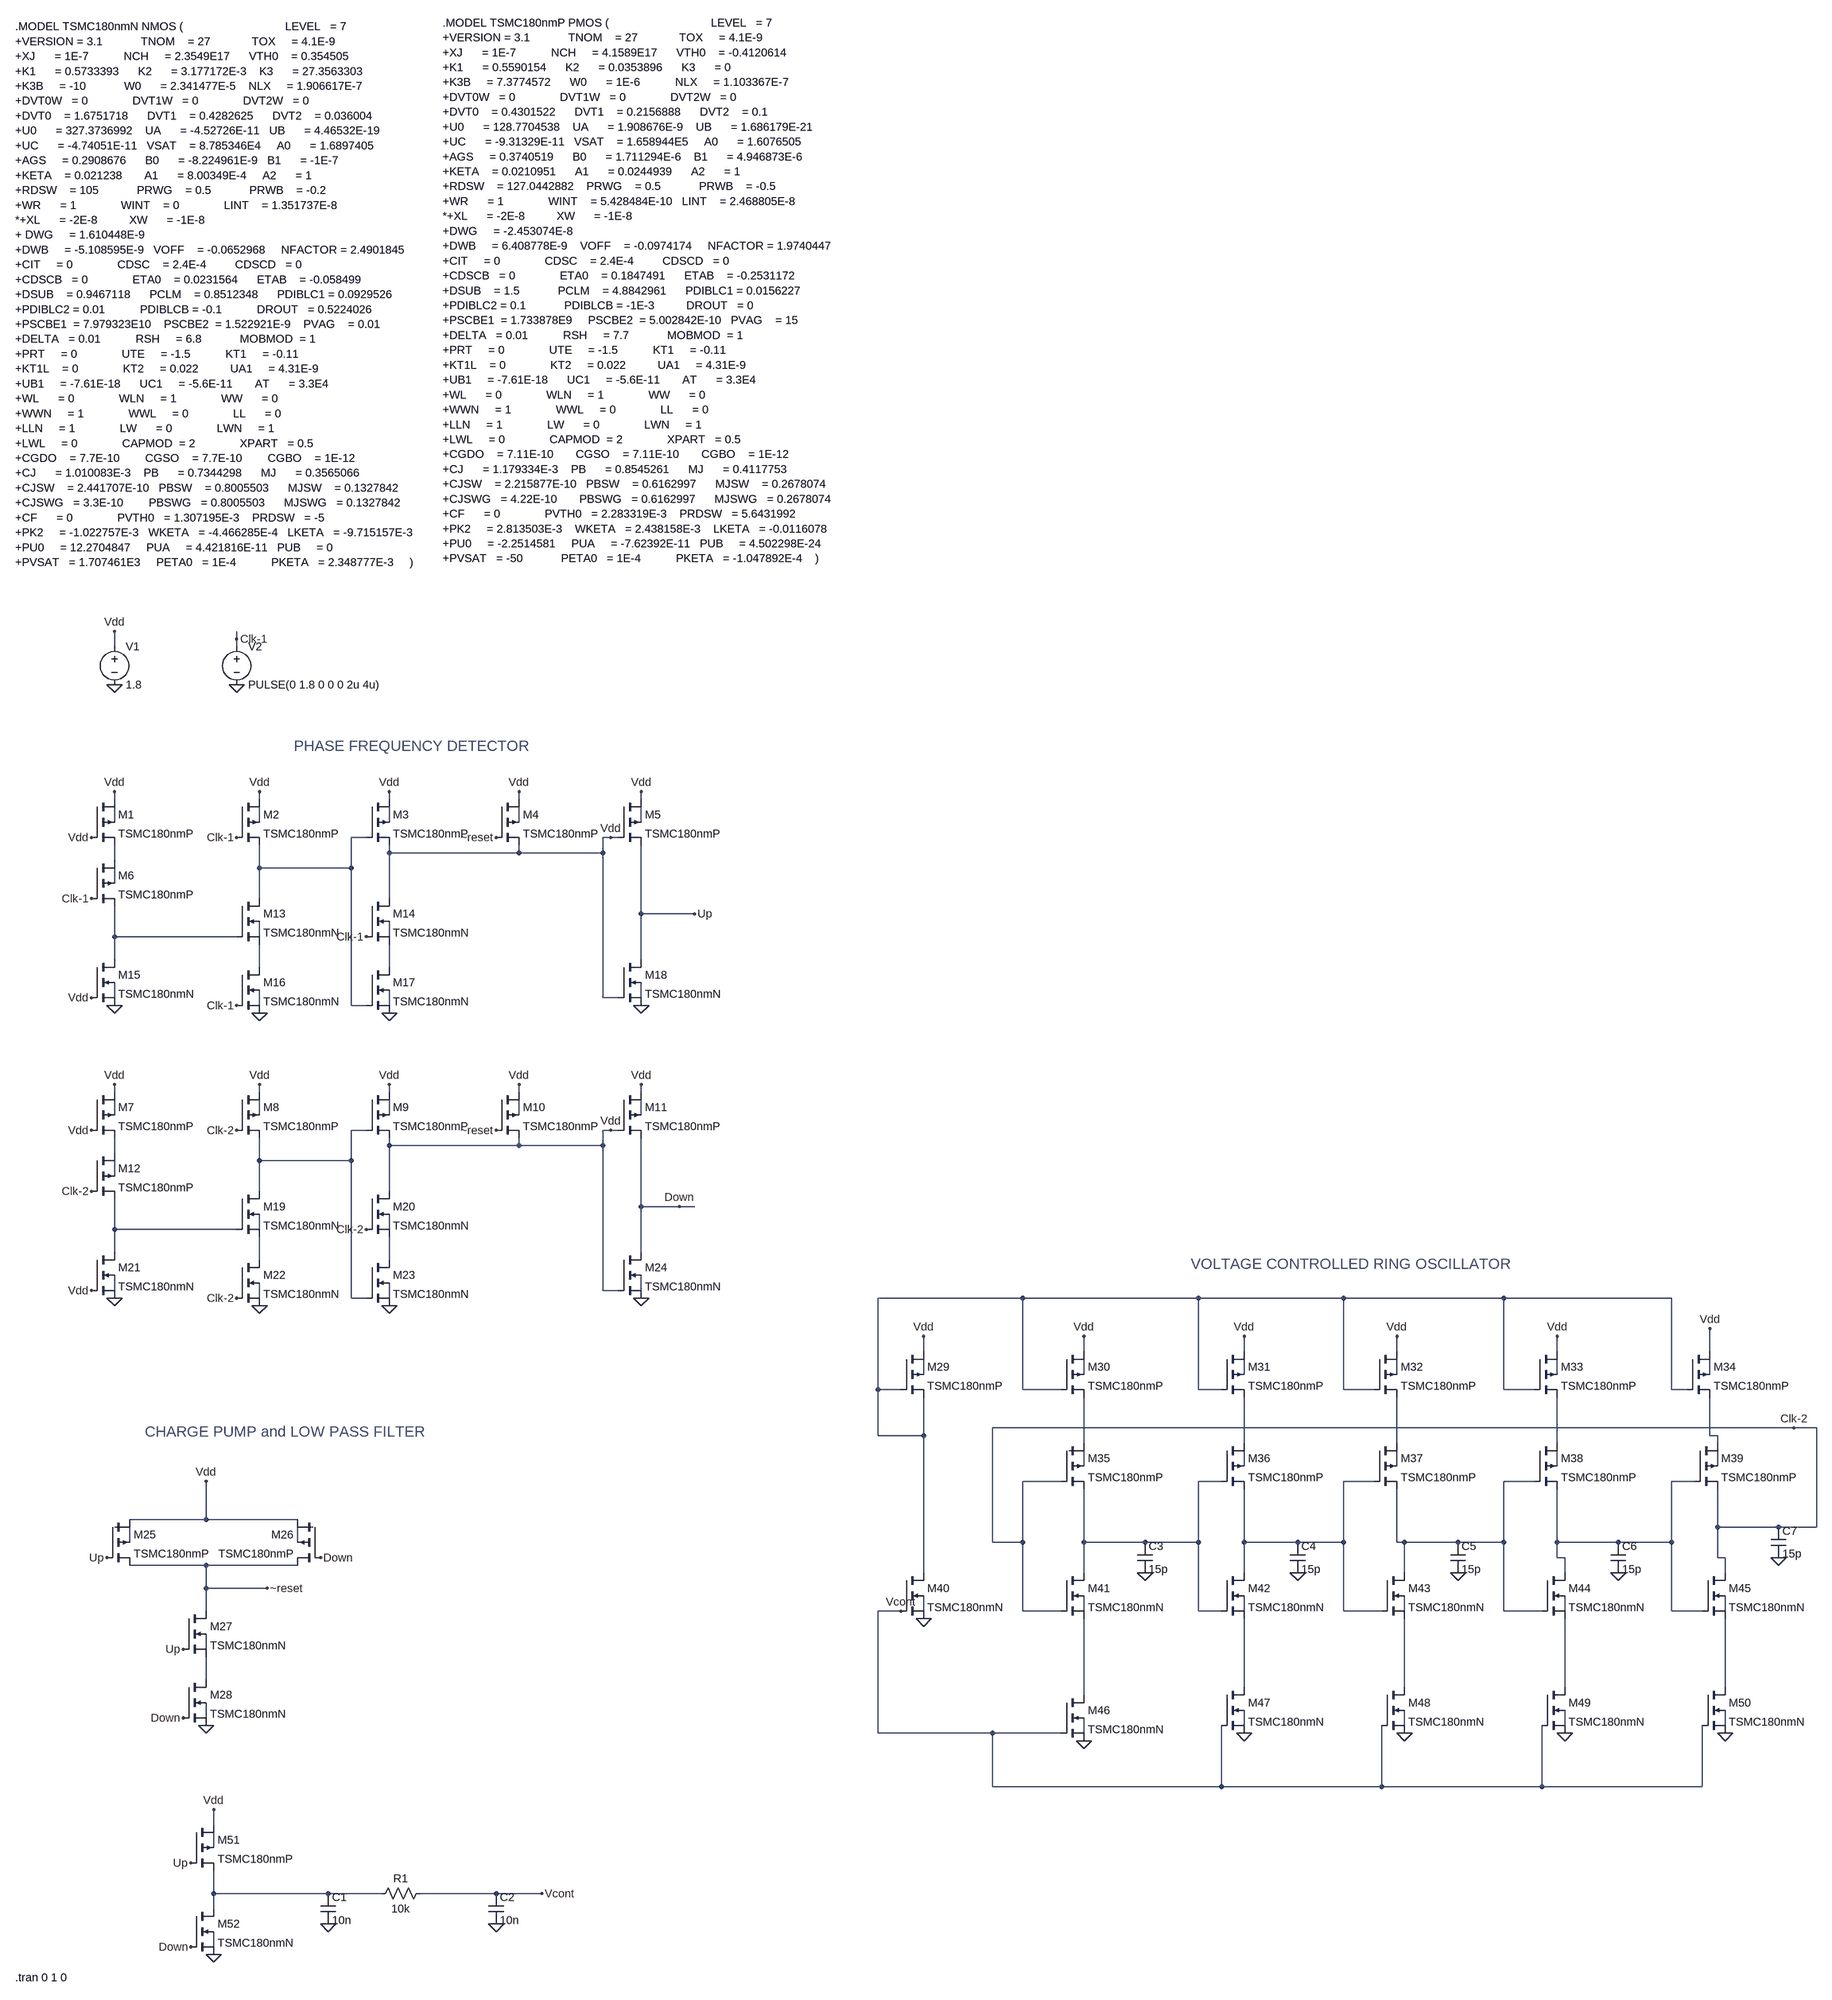
[diagram p0: schematic On-chip_PLL.asc]
On-chip_PLL.asc, the LTspice schematic file:
Version 4
SHEET 1 3548 2176
WIRE 80 -704 80 -720
WIRE -176 -688 -176 -720
WIRE 80 -688 80 -704
WIRE -176 -368 -176 -384
WIRE 128 -368 128 -384
WIRE 400 -368 400 -384
WIRE 672 -368 672 -384
WIRE 928 -368 928 -384
WIRE -176 -352 -192 -352
WIRE 128 -352 112 -352
WIRE 400 -352 384 -352
WIRE 672 -352 656 -352
WIRE 928 -352 912 -352
WIRE -176 -320 -176 -352
WIRE 128 -320 128 -352
WIRE 400 -320 400 -352
WIRE 672 -320 672 -352
WIRE 928 -320 928 -352
WIRE 352 -288 320 -288
WIRE 864 -288 848 -288
WIRE 880 -288 864 -288
WIRE 400 -256 400 -272
WIRE 672 -256 672 -272
WIRE 672 -256 400 -256
WIRE 848 -256 848 -288
WIRE 848 -256 672 -256
WIRE -176 -240 -176 -272
WIRE -176 -224 -192 -224
WIRE 128 -224 128 -272
WIRE 320 -224 320 -288
WIRE 320 -224 128 -224
WIRE -176 -192 -176 -224
WIRE 128 -160 128 -224
WIRE 400 -160 400 -256
WIRE 928 -128 928 -272
WIRE 1040 -128 928 -128
WIRE -176 -80 -176 -144
WIRE 80 -80 -176 -80
WIRE 128 -80 128 -112
WIRE 128 -80 112 -80
WIRE 400 -80 400 -112
WIRE 400 -80 384 -80
WIRE -176 -32 -176 -80
WIRE 928 -32 928 -128
WIRE 128 -16 128 -64
WIRE 400 -16 400 -64
WIRE -176 48 -176 16
WIRE -176 48 -192 48
WIRE 848 48 848 -256
WIRE 880 48 848 48
WIRE 928 48 928 16
WIRE 928 48 912 48
WIRE 128 64 128 32
WIRE 128 64 112 64
WIRE 320 64 320 -224
WIRE 352 64 320 64
WIRE 400 64 400 32
WIRE 400 64 384 64
WIRE -176 304 -176 288
WIRE 128 304 128 288
WIRE 400 304 400 288
WIRE 672 304 672 288
WIRE 928 304 928 288
WIRE -176 320 -192 320
WIRE 128 320 112 320
WIRE 400 320 384 320
WIRE 672 320 656 320
WIRE 928 320 912 320
WIRE -176 352 -176 320
WIRE 128 352 128 320
WIRE 400 352 400 320
WIRE 672 352 672 320
WIRE 928 352 928 320
WIRE 352 384 320 384
WIRE 864 384 848 384
WIRE 880 384 864 384
WIRE 400 416 400 400
WIRE 672 416 672 400
WIRE 672 416 400 416
WIRE 848 416 848 384
WIRE 848 416 672 416
WIRE -176 432 -176 400
WIRE -176 448 -192 448
WIRE 128 448 128 400
WIRE 320 448 320 384
WIRE 320 448 128 448
WIRE -176 480 -176 448
WIRE 128 512 128 448
WIRE 400 512 400 416
WIRE 928 544 928 400
WIRE 1008 544 928 544
WIRE 1040 544 1008 544
WIRE -176 592 -176 528
WIRE 80 592 -176 592
WIRE 128 592 128 560
WIRE 128 592 112 592
WIRE 400 592 400 560
WIRE 400 592 384 592
WIRE -176 640 -176 592
WIRE 928 640 928 544
WIRE 128 656 128 608
WIRE 400 656 400 608
WIRE -176 720 -176 688
WIRE -176 720 -192 720
WIRE 848 720 848 416
WIRE 880 720 848 720
WIRE 928 720 928 688
WIRE 928 720 912 720
WIRE 128 736 128 704
WIRE 128 736 112 736
WIRE 320 736 320 448
WIRE 352 736 320 736
WIRE 400 736 400 704
WIRE 400 736 384 736
WIRE 1728 736 1424 736
WIRE 2096 736 1728 736
WIRE 2400 736 2096 736
WIRE 2736 736 2400 736
WIRE 3088 736 2736 736
WIRE 1520 848 1520 816
WIRE 1856 848 1856 816
WIRE 2192 848 2192 816
WIRE 2512 848 2512 816
WIRE 2848 848 2848 816
WIRE 3168 848 3168 800
WIRE 1520 864 1504 864
WIRE 2192 864 2176 864
WIRE 2512 864 2496 864
WIRE 2848 864 2832 864
WIRE 3168 864 3152 864
WIRE 1520 896 1520 864
WIRE 1856 896 1856 864
WIRE 2192 896 2192 864
WIRE 2512 896 2512 864
WIRE 2848 896 2848 864
WIRE 3168 896 3168 864
WIRE 1424 928 1424 736
WIRE 1472 928 1424 928
WIRE 1728 928 1728 736
WIRE 1808 928 1728 928
WIRE 2096 928 2096 736
WIRE 2144 928 2096 928
WIRE 2400 928 2400 736
WIRE 2464 928 2400 928
WIRE 2736 928 2736 736
WIRE 2800 928 2736 928
WIRE 3088 928 3088 736
WIRE 3120 928 3088 928
WIRE 3344 1008 1664 1008
WIRE 3392 1008 3344 1008
WIRE 1424 1024 1424 928
WIRE 1520 1024 1520 944
WIRE 1520 1024 1424 1024
WIRE 3168 1024 3168 944
WIRE 3184 1024 3168 1024
WIRE 1856 1040 1856 944
WIRE 2192 1040 2192 944
WIRE 2512 1040 2512 944
WIRE 2848 1040 2848 944
WIRE 3184 1040 3184 1024
WIRE 1856 1056 1824 1056
WIRE 2512 1056 2496 1056
WIRE 2848 1056 2832 1056
WIRE 3184 1056 3168 1056
WIRE 1856 1088 1856 1056
WIRE 2192 1088 2192 1056
WIRE 2512 1088 2512 1056
WIRE 2848 1088 2848 1056
WIRE 3184 1088 3184 1056
WIRE 1808 1120 1728 1120
WIRE 2144 1120 2096 1120
WIRE 2464 1120 2400 1120
WIRE 2800 1120 2736 1120
WIRE 3136 1120 3088 1120
WIRE 16 1200 16 1120
WIRE 16 1200 -144 1200
WIRE 208 1200 16 1200
WIRE -144 1216 -176 1216
WIRE 240 1216 208 1216
WIRE 3184 1216 3184 1136
WIRE 3312 1216 3184 1216
WIRE 3392 1216 3392 1008
WIRE 3392 1216 3312 1216
WIRE -144 1248 -144 1216
WIRE 208 1248 208 1216
WIRE 1664 1248 1664 1008
WIRE 1728 1248 1728 1120
WIRE 1728 1248 1664 1248
WIRE 1856 1248 1856 1136
WIRE 1984 1248 1856 1248
WIRE 2096 1248 2096 1120
WIRE 2096 1248 1984 1248
WIRE 2192 1248 2192 1136
WIRE 2304 1248 2192 1248
WIRE 2400 1248 2400 1120
WIRE 2400 1248 2304 1248
WIRE 2512 1248 2512 1136
WIRE 2528 1248 2512 1248
WIRE 2640 1248 2528 1248
WIRE 2736 1248 2736 1120
WIRE 2736 1248 2640 1248
WIRE 2848 1248 2848 1136
WIRE 2976 1248 2848 1248
WIRE 3088 1248 3088 1120
WIRE 3088 1248 2976 1248
WIRE 2848 1280 2848 1248
WIRE 2864 1280 2848 1280
WIRE 3184 1280 3184 1216
WIRE 3200 1280 3184 1280
WIRE 16 1296 -144 1296
WIRE 208 1296 16 1296
WIRE 1520 1312 1520 1024
WIRE 1856 1312 1856 1248
WIRE 2192 1312 2192 1248
WIRE 2528 1312 2528 1248
WIRE 2864 1312 2864 1280
WIRE 3200 1312 3200 1280
WIRE 16 1344 16 1296
WIRE 144 1344 16 1344
WIRE 16 1392 16 1344
WIRE 1472 1392 1424 1392
WIRE 1520 1392 1520 1360
WIRE 1520 1392 1504 1392
WIRE 1728 1392 1728 1248
WIRE 1808 1392 1728 1392
WIRE 1856 1392 1856 1360
WIRE 1856 1392 1840 1392
WIRE 2096 1392 2096 1248
WIRE 2144 1392 2096 1392
WIRE 2192 1392 2192 1360
WIRE 2192 1392 2176 1392
WIRE 2400 1392 2400 1248
WIRE 2480 1392 2400 1392
WIRE 2528 1392 2528 1360
WIRE 2528 1392 2512 1392
WIRE 2736 1392 2736 1248
WIRE 2816 1392 2736 1392
WIRE 2864 1392 2864 1360
WIRE 2864 1392 2848 1392
WIRE 3088 1392 3088 1248
WIRE 3152 1392 3088 1392
WIRE 3200 1392 3200 1360
WIRE 3200 1392 3184 1392
WIRE 16 1472 16 1440
WIRE 16 1536 16 1488
WIRE 2192 1552 2192 1408
WIRE 2528 1552 2528 1408
WIRE 2864 1552 2864 1408
WIRE 3200 1552 3200 1408
WIRE 1856 1568 1856 1408
WIRE 16 1616 16 1584
WIRE 2192 1632 2192 1600
WIRE 2192 1632 2176 1632
WIRE 2528 1632 2528 1600
WIRE 2528 1632 2512 1632
WIRE 2864 1632 2864 1600
WIRE 2864 1632 2848 1632
WIRE 3200 1632 3200 1600
WIRE 3200 1632 3184 1632
WIRE 1424 1648 1424 1392
WIRE 1664 1648 1424 1648
WIRE 1808 1648 1664 1648
WIRE 1856 1648 1856 1616
WIRE 1856 1648 1840 1648
WIRE 1664 1760 1664 1648
WIRE 2144 1760 2144 1632
WIRE 2144 1760 1664 1760
WIRE 2480 1760 2480 1632
WIRE 2480 1760 2144 1760
WIRE 2816 1760 2816 1632
WIRE 2816 1760 2480 1760
WIRE 3152 1760 3152 1632
WIRE 3152 1760 2816 1760
WIRE 32 1840 32 1808
WIRE 32 1856 16 1856
WIRE 32 1888 32 1856
WIRE 32 1984 32 1936
WIRE 272 1984 32 1984
WIRE 384 1984 272 1984
WIRE 624 1984 464 1984
WIRE 720 1984 624 1984
WIRE 32 2016 32 1984
WIRE 32 2096 32 2064
FLAG 1008 544 Down
FLAG 80 -704 Clk-1
FLAG -224 -160 Clk-1
FLAG 80 -288 Clk-1
FLAG 80 64 Clk-1
FLAG 352 -80 Clk-1
FLAG -224 512 Clk-2
FLAG 80 736 Clk-2
FLAG 80 384 Clk-2
FLAG 352 592 Clk-2
FLAG -224 720 Vdd
FLAG -224 384 Vdd
FLAG -224 48 Vdd
FLAG -224 -288 Vdd
FLAG -176 288 Vdd
FLAG 128 288 Vdd
FLAG 400 288 Vdd
FLAG -176 -384 Vdd
FLAG 128 -384 Vdd
FLAG 400 -384 Vdd
FLAG 672 -384 Vdd
FLAG 928 -384 Vdd
FLAG 864 -288 Vdd
FLAG 672 288 Vdd
FLAG 928 288 Vdd
FLAG 864 384 Vdd
FLAG 624 -288 ~reset
FLAG 624 384 ~reset
FLAG -176 -720 Vdd
FLAG -192 1280 Up
FLAG -32 1472 Up
FLAG -32 1616 Down
FLAG 144 1344 ~reset
FLAG 16 1120 Vdd
FLAG 1520 816 Vdd
FLAG 1856 816 Vdd
FLAG 2192 816 Vdd
FLAG 2512 816 Vdd
FLAG 2848 816 Vdd
FLAG 3168 800 Vdd
FLAG 3344 1008 Clk-2
FLAG 1472 1392 Vcont
FLAG 16 1632 0
FLAG -16 2096 Down
FLAG 720 1984 Vcont
FLAG 32 2112 0
FLAG 272 2048 0
FLAG 624 2048 0
FLAG -176 64 0
FLAG 128 80 0
FLAG 400 80 0
FLAG 928 64 0
FLAG -176 736 0
FLAG 128 752 0
FLAG 400 752 0
FLAG 928 736 0
FLAG 1520 1408 0
FLAG 1856 1664 0
FLAG 2192 1648 0
FLAG 2528 1648 0
FLAG 2864 1648 0
FLAG 3200 1648 0
FLAG -176 -608 0
FLAG 80 -608 0
FLAG 1040 -128 Up
FLAG 256 1280 Down
FLAG -16 1920 Up
FLAG 32 1808 Vdd
FLAG 1984 1312 0
FLAG 2304 1312 0
FLAG 2640 1312 0
FLAG 2976 1312 0
FLAG 3312 1280 0
SYMBOL pmos4 -224 -368 R0
SYMATTR InstName M1
SYMATTR Value TSMC180nmP
SYMBOL pmos4 80 -368 R0
SYMATTR InstName M2
SYMATTR Value TSMC180nmP
SYMBOL pmos4 352 -368 R0
SYMATTR InstName M3
SYMATTR Value TSMC180nmP
SYMBOL pmos4 624 -368 R0
SYMATTR InstName M4
SYMATTR Value TSMC180nmP
SYMBOL pmos4 880 -368 R0
SYMATTR InstName M5
SYMATTR Value TSMC180nmP
SYMBOL pmos4 -224 -240 R0
SYMATTR InstName M6
SYMATTR Value TSMC180nmP
SYMBOL nmos4 80 -160 R0
SYMATTR InstName M13
SYMATTR Value TSMC180nmN
SYMBOL nmos4 352 -160 R0
SYMATTR InstName M14
SYMATTR Value TSMC180nmN
SYMBOL nmos4 -224 -32 R0
SYMATTR InstName M15
SYMATTR Value TSMC180nmN
SYMBOL nmos4 80 -16 R0
SYMATTR InstName M16
SYMATTR Value TSMC180nmN
SYMBOL nmos4 352 -16 R0
SYMATTR InstName M17
SYMATTR Value TSMC180nmN
SYMBOL nmos4 880 -32 R0
SYMATTR InstName M18
SYMATTR Value TSMC180nmN
SYMBOL pmos4 -224 304 R0
SYMATTR InstName M7
SYMATTR Value TSMC180nmP
SYMBOL pmos4 80 304 R0
SYMATTR InstName M8
SYMATTR Value TSMC180nmP
SYMBOL pmos4 352 304 R0
SYMATTR InstName M9
SYMATTR Value TSMC180nmP
SYMBOL pmos4 624 304 R0
SYMATTR InstName M10
SYMATTR Value TSMC180nmP
SYMBOL pmos4 880 304 R0
SYMATTR InstName M11
SYMATTR Value TSMC180nmP
SYMBOL pmos4 -224 432 R0
SYMATTR InstName M12
SYMATTR Value TSMC180nmP
SYMBOL nmos4 80 512 R0
SYMATTR InstName M19
SYMATTR Value TSMC180nmN
SYMBOL nmos4 352 512 R0
SYMATTR InstName M20
SYMATTR Value TSMC180nmN
SYMBOL nmos4 -224 640 R0
SYMATTR InstName M21
SYMATTR Value TSMC180nmN
SYMBOL nmos4 80 656 R0
SYMATTR InstName M22
SYMATTR Value TSMC180nmN
SYMBOL nmos4 352 656 R0
SYMATTR InstName M23
SYMATTR Value TSMC180nmN
SYMBOL nmos4 880 640 R0
SYMATTR InstName M24
SYMATTR Value TSMC180nmN
SYMBOL voltage -176 -704 R0
WINDOW 123 0 0 Left 0
WINDOW 39 0 0 Left 0
SYMATTR InstName V1
SYMATTR Value 1.8
SYMBOL voltage 80 -704 R0
WINDOW 123 0 0 Left 0
WINDOW 39 0 0 Left 0
SYMATTR InstName V2
SYMATTR Value PULSE(0 1.8 0 0 0 2u 4u)
SYMBOL pmos4 -192 1200 R0
SYMATTR InstName M25
SYMATTR Value TSMC180nmP
SYMBOL nmos4 -32 1392 R0
SYMATTR InstName M27
SYMATTR Value TSMC180nmN
SYMBOL nmos4 -32 1536 R0
SYMATTR InstName M28
SYMATTR Value TSMC180nmN
SYMBOL pmos4 1472 848 R0
SYMATTR InstName M29
SYMATTR Value TSMC180nmP
SYMBOL pmos4 1808 848 R0
SYMATTR InstName M30
SYMATTR Value TSMC180nmP
SYMBOL pmos4 2144 848 R0
SYMATTR InstName M31
SYMATTR Value TSMC180nmP
SYMBOL pmos4 2464 848 R0
SYMATTR InstName M32
SYMATTR Value TSMC180nmP
SYMBOL pmos4 2800 848 R0
SYMATTR InstName M33
SYMATTR Value TSMC180nmP
SYMBOL pmos4 3120 848 R0
SYMATTR InstName M34
SYMATTR Value TSMC180nmP
SYMBOL pmos4 1808 1040 R0
SYMATTR InstName M35
SYMATTR Value TSMC180nmP
SYMBOL pmos4 2144 1040 R0
SYMATTR InstName M36
SYMATTR Value TSMC180nmP
SYMBOL pmos4 2464 1040 R0
SYMATTR InstName M37
SYMATTR Value TSMC180nmP
SYMBOL pmos4 2800 1040 R0
SYMATTR InstName M38
SYMATTR Value TSMC180nmP
SYMBOL pmos4 3136 1040 R0
SYMATTR InstName M39
SYMATTR Value TSMC180nmP
SYMBOL nmos4 1472 1312 R0
SYMATTR InstName M40
SYMATTR Value TSMC180nmN
SYMBOL nmos4 1808 1312 R0
SYMATTR InstName M41
SYMATTR Value TSMC180nmN
SYMBOL nmos4 2144 1312 R0
SYMATTR InstName M42
SYMATTR Value TSMC180nmN
SYMBOL nmos4 2480 1312 R0
SYMATTR InstName M43
SYMATTR Value TSMC180nmN
SYMBOL nmos4 2816 1312 R0
SYMATTR InstName M44
SYMATTR Value TSMC180nmN
SYMBOL nmos4 3152 1312 R0
SYMATTR InstName M45
SYMATTR Value TSMC180nmN
SYMBOL nmos4 1808 1568 R0
SYMATTR InstName M46
SYMATTR Value TSMC180nmN
SYMBOL nmos4 2144 1552 R0
SYMATTR InstName M47
SYMATTR Value TSMC180nmN
SYMBOL nmos4 2480 1552 R0
SYMATTR InstName M48
SYMATTR Value TSMC180nmN
SYMBOL nmos4 2816 1552 R0
SYMATTR InstName M49
SYMATTR Value TSMC180nmN
SYMBOL nmos4 3152 1552 R0
SYMATTR InstName M50
SYMATTR Value TSMC180nmN
SYMBOL nmos4 -16 2016 R0
SYMATTR InstName M52
SYMATTR Value TSMC180nmN
SYMBOL cap 256 1984 R0
SYMATTR InstName C1
SYMATTR Value 10n
SYMBOL cap 608 1984 R0
SYMATTR InstName C2
SYMATTR Value 10n
SYMBOL res 480 1968 R90
WINDOW 0 0 56 VBottom 2
WINDOW 3 32 56 VTop 2
SYMATTR InstName R1
SYMATTR Value 10k
SYMBOL pmos4 256 1200 M0
SYMATTR InstName M26
SYMATTR Value TSMC180nmP
SYMBOL pmos4 -16 1840 R0
SYMATTR InstName M51
SYMATTR Value TSMC180nmP
SYMBOL cap 1968 1248 R0
SYMATTR InstName C3
SYMATTR Value 15p
SYMBOL cap 2288 1248 R0
SYMATTR InstName C4
SYMATTR Value 15p
SYMBOL cap 2624 1248 R0
SYMATTR InstName C5
SYMATTR Value 15p
SYMBOL cap 2960 1248 R0
SYMATTR InstName C6
SYMATTR Value 15p
SYMBOL cap 3296 1216 R0
SYMATTR InstName C7
SYMATTR Value 15p
TEXT -384 -2008 Left 2 !.MODEL TSMC180nmN NMOS (                                LEVEL   = 7\n+VERSION = 3.1            TNOM    = 27             TOX     = 4.1E-9\n+XJ      = 1E-7           NCH     = 2.3549E17      VTH0    = 0.354505\n+K1      = 0.5733393      K2      = 3.177172E-3    K3      = 27.3563303\n+K3B     = -10            W0      = 2.341477E-5    NLX     = 1.906617E-7\n+DVT0W   = 0              DVT1W   = 0              DVT2W   = 0\n+DVT0    = 1.6751718      DVT1    = 0.4282625      DVT2    = 0.036004\n+U0      = 327.3736992    UA      = -4.52726E-11   UB      = 4.46532E-19\n+UC      = -4.74051E-11   VSAT    = 8.785346E4     A0      = 1.6897405\n+AGS     = 0.2908676      B0      = -8.224961E-9   B1      = -1E-7\n+KETA    = 0.021238       A1      = 8.00349E-4     A2      = 1\n+RDSW    = 105            PRWG    = 0.5            PRWB    = -0.2\n+WR      = 1              WINT    = 0              LINT    = 1.351737E-8\n*+XL      = -2E-8          XW      = -1E-8         \n+ DWG     = 1.610448E-9\n+DWB     = -5.108595E-9   VOFF    = -0.0652968     NFACTOR = 2.4901845\n+CIT     = 0              CDSC    = 2.4E-4         CDSCD   = 0\n+CDSCB   = 0              ETA0    = 0.0231564      ETAB    = -0.058499\n+DSUB    = 0.9467118      PCLM    = 0.8512348      PDIBLC1 = 0.0929526\n+PDIBLC2 = 0.01           PDIBLCB = -0.1           DROUT   = 0.5224026\n+PSCBE1  = 7.979323E10    PSCBE2  = 1.522921E-9    PVAG    = 0.01\n+DELTA   = 0.01           RSH     = 6.8            MOBMOD  = 1\n+PRT     = 0              UTE     = -1.5           KT1     = -0.11\n+KT1L    = 0              KT2     = 0.022          UA1     = 4.31E-9\n+UB1     = -7.61E-18      UC1     = -5.6E-11       AT      = 3.3E4\n+WL      = 0              WLN     = 1              WW      = 0\n+WWN     = 1              WWL     = 0              LL      = 0\n+LLN     = 1              LW      = 0              LWN     = 1\n+LWL     = 0              CAPMOD  = 2              XPART   = 0.5\n+CGDO    = 7.7E-10        CGSO    = 7.7E-10        CGBO    = 1E-12\n+CJ      = 1.010083E-3    PB      = 0.7344298      MJ      = 0.3565066\n+CJSW    = 2.441707E-10   PBSW    = 0.8005503      MJSW    = 0.1327842\n+CJSWG   = 3.3E-10        PBSWG   = 0.8005503      MJSWG   = 0.1327842\n+CF      = 0              PVTH0   = 1.307195E-3    PRDSW   = -5\n+PK2     = -1.022757E-3   WKETA   = -4.466285E-4   LKETA   = -9.715157E-3\n+PU0     = 12.2704847     PUA     = 4.421816E-11   PUB     = 0\n+PVSAT   = 1.707461E3     PETA0   = 1E-4           PKETA   = 2.348777E-3     )
TEXT 512 -2016 Left 2 !.MODEL TSMC180nmP PMOS (                                LEVEL   = 7\n+VERSION = 3.1            TNOM    = 27             TOX     = 4.1E-9\n+XJ      = 1E-7           NCH     = 4.1589E17      VTH0    = -0.4120614\n+K1      = 0.5590154      K2      = 0.0353896      K3      = 0\n+K3B     = 7.3774572      W0      = 1E-6           NLX     = 1.103367E-7\n+DVT0W   = 0              DVT1W   = 0              DVT2W   = 0\n+DVT0    = 0.4301522      DVT1    = 0.2156888      DVT2    = 0.1\n+U0      = 128.7704538    UA      = 1.908676E-9    UB      = 1.686179E-21\n+UC      = -9.31329E-11   VSAT    = 1.658944E5     A0      = 1.6076505\n+AGS     = 0.3740519      B0      = 1.711294E-6    B1      = 4.946873E-6\n+KETA    = 0.0210951      A1      = 0.0244939      A2      = 1\n+RDSW    = 127.0442882    PRWG    = 0.5            PRWB    = -0.5\n+WR      = 1              WINT    = 5.428484E-10   LINT    = 2.468805E-8\n*+XL      = -2E-8          XW      = -1E-8          \n+DWG     = -2.453074E-8\n+DWB     = 6.408778E-9    VOFF    = -0.0974174     NFACTOR = 1.9740447\n+CIT     = 0              CDSC    = 2.4E-4         CDSCD   = 0\n+CDSCB   = 0              ETA0    = 0.1847491      ETAB    = -0.2531172\n+DSUB    = 1.5            PCLM    = 4.8842961      PDIBLC1 = 0.0156227\n+PDIBLC2 = 0.1            PDIBLCB = -1E-3          DROUT   = 0\n+PSCBE1  = 1.733878E9     PSCBE2  = 5.002842E-10   PVAG    = 15\n+DELTA   = 0.01           RSH     = 7.7            MOBMOD  = 1\n+PRT     = 0              UTE     = -1.5           KT1     = -0.11\n+KT1L    = 0              KT2     = 0.022          UA1     = 4.31E-9\n+UB1     = -7.61E-18      UC1     = -5.6E-11       AT      = 3.3E4\n+WL      = 0              WLN     = 1              WW      = 0\n+WWN     = 1              WWL     = 0              LL      = 0\n+LLN     = 1              LW      = 0              LWN     = 1\n+LWL     = 0              CAPMOD  = 2              XPART   = 0.5\n+CGDO    = 7.11E-10       CGSO    = 7.11E-10       CGBO    = 1E-12\n+CJ      = 1.179334E-3    PB      = 0.8545261      MJ      = 0.4117753\n+CJSW    = 2.215877E-10   PBSW    = 0.6162997      MJSW    = 0.2678074\n+CJSWG   = 4.22E-10       PBSWG   = 0.6162997      MJSWG   = 0.2678074\n+CF      = 0              PVTH0   = 2.283319E-3    PRDSW   = 5.6431992\n+PK2     = 2.813503E-3    WKETA   = 2.438158E-3    LKETA   = -0.0116078\n+PU0     = -2.2514581     PUA     = -7.62392E-11   PUB     = 4.502298E-24\n+PVSAT   = -50            PETA0   = 1E-4           PKETA   = -1.047892E-4    )
TEXT 200 -480 Left 3 ;PHASE FREQUENCY DETECTOR
TEXT -112 1016 Left 3 ;CHARGE PUMP and LOW PASS FILTER
TEXT 2080 664 Left 3 ;VOLTAGE CONTROLLED RING OSCILLATOR
TEXT -384 2160 Left 2 !.tran 0 1 0

The netlist it stands for:
* On-chip_PLL.asc
M1 Vdd Vdd N007 N001 TSMC180nmP
M2 Vdd Clk-1 N006 N002 TSMC180nmP
M3 Vdd N006 Vdd N003 TSMC180nmP
M4 Vdd ~reset Vdd N004 TSMC180nmP
M5 Vdd Vdd Up N005 TSMC180nmP
M6 N007 Clk-1 N009 N008 TSMC180nmP
M13 N006 N009 N012 N010 TSMC180nmN
M14 Vdd Clk-1 N013 N011 TSMC180nmN
M15 N009 Vdd 0 N014 TSMC180nmN
M16 N012 Clk-1 0 N016 TSMC180nmN
M17 N013 N006 0 N017 TSMC180nmN
M18 Up Vdd 0 N015 TSMC180nmN
M7 Vdd Vdd N024 N018 TSMC180nmP
M8 Vdd Clk-2 N023 N019 TSMC180nmP
M9 Vdd N023 Vdd N020 TSMC180nmP
M10 Vdd ~reset Vdd N021 TSMC180nmP
M11 Vdd Vdd Down N022 TSMC180nmP
M12 N024 Clk-2 N026 N025 TSMC180nmP
M19 N023 N026 N029 N027 TSMC180nmN
M20 Vdd Clk-2 N030 N028 TSMC180nmN
M21 N026 Vdd 0 N031 TSMC180nmN
M22 N029 Clk-2 0 N033 TSMC180nmN
M23 N030 N023 0 N034 TSMC180nmN
M24 Down Vdd 0 N032 TSMC180nmN
V1 Vdd 0 1.8
V2 Clk-1 0 PULSE(0 1.8 0 0 0 2u 4u)
M25 Vdd Up ~reset N056 TSMC180nmP
M27 ~reset Up N065 N064 TSMC180nmN
M28 N065 Down 0 N071 TSMC180nmN
M29 Vdd N035 N035 N036 TSMC180nmP
M30 Vdd N035 N043 N041 TSMC180nmP
M31 Vdd N035 N044 N037 TSMC180nmP
M32 Vdd N035 N045 N038 TSMC180nmP
M33 Vdd N035 N046 N039 TSMC180nmP
M34 Vdd N035 N042 N040 TSMC180nmP
M35 N043 Clk-2 N052 N047 TSMC180nmP
M36 N044 N052 N053 N051 TSMC180nmP
M37 N045 N053 N054 N048 TSMC180nmP
M38 N046 N054 N055 N049 TSMC180nmP
M39 N042 N055 Clk-2 N050 TSMC180nmP
M40 N035 Vcont 0 N058 TSMC180nmN
M41 N052 Clk-2 N070 N059 TSMC180nmN
M42 N053 N052 N066 N060 TSMC180nmN
M43 N054 N053 N067 N061 TSMC180nmN
M44 N055 N054 N068 N062 TSMC180nmN
M45 Clk-2 N055 N069 N063 TSMC180nmN
M46 N070 Vcont 0 N076 TSMC180nmN
M47 N066 Vcont 0 N072 TSMC180nmN
M48 N067 Vcont 0 N073 TSMC180nmN
M49 N068 Vcont 0 N074 TSMC180nmN
M50 N069 Vcont 0 N075 TSMC180nmN
M52 N078 Down 0 N079 TSMC180nmN
C1 N078 0 10n
C2 Vcont 0 10n
R1 Vcont N078 10k
M26 Vdd Down ~reset N057 TSMC180nmP
M51 Vdd Up N078 N077 TSMC180nmP
C3 N052 0 15p
C4 N053 0 15p
C5 N054 0 15p
C6 N055 0 15p
C7 Clk-2 0 15p
.model NMOS NMOS
.model PMOS PMOS
.lib standard.mos
.MODEL TSMC180nmN NMOS (                                LEVEL   = 7
+VERSION = 3.1            TNOM    = 27             TOX     = 4.1E-9
+XJ      = 1E-7           NCH     = 2.3549E17      VTH0    = 0.354505
+K1      = 0.5733393      K2      = 3.177172E-3    K3      = 27.3563303
+K3B     = -10            W0      = 2.341477E-5    NLX     = 1.906617E-7
+DVT0W   = 0              DVT1W   = 0              DVT2W   = 0
+DVT0    = 1.6751718      DVT1    = 0.4282625      DVT2    = 0.036004
+U0      = 327.3736992    UA      = -4.52726E-11   UB      = 4.46532E-19
+UC      = -4.74051E-11   VSAT    = 8.785346E4     A0      = 1.6897405
+AGS     = 0.2908676      B0      = -8.224961E-9   B1      = -1E-7
+KETA    = 0.021238       A1      = 8.00349E-4     A2      = 1
+RDSW    = 105            PRWG    = 0.5            PRWB    = -0.2
+WR      = 1              WINT    = 0              LINT    = 1.351737E-8
*+XL      = -2E-8          XW      = -1E-8
+ DWG     = 1.610448E-9
+DWB     = -5.108595E-9   VOFF    = -0.0652968     NFACTOR = 2.4901845
+CIT     = 0              CDSC    = 2.4E-4         CDSCD   = 0
+CDSCB   = 0              ETA0    = 0.0231564      ETAB    = -0.058499
+DSUB    = 0.9467118      PCLM    = 0.8512348      PDIBLC1 = 0.0929526
+PDIBLC2 = 0.01           PDIBLCB = -0.1           DROUT   = 0.5224026
+PSCBE1  = 7.979323E10    PSCBE2  = 1.522921E-9    PVAG    = 0.01
+DELTA   = 0.01           RSH     = 6.8            MOBMOD  = 1
+PRT     = 0              UTE     = -1.5           KT1     = -0.11
+KT1L    = 0              KT2     = 0.022          UA1     = 4.31E-9
+UB1     = -7.61E-18      UC1     = -5.6E-11       AT      = 3.3E4
+WL      = 0              WLN     = 1              WW      = 0
+WWN     = 1              WWL     = 0              LL      = 0
+LLN     = 1              LW      = 0              LWN     = 1
+LWL     = 0              CAPMOD  = 2              XPART   = 0.5
+CGDO    = 7.7E-10        CGSO    = 7.7E-10        CGBO    = 1E-12
+CJ      = 1.010083E-3    PB      = 0.7344298      MJ      = 0.3565066
+CJSW    = 2.441707E-10   PBSW    = 0.8005503      MJSW    = 0.1327842
+CJSWG   = 3.3E-10        PBSWG   = 0.8005503      MJSWG   = 0.1327842
+CF      = 0              PVTH0   = 1.307195E-3    PRDSW   = -5
+PK2     = -1.022757E-3   WKETA   = -4.466285E-4   LKETA   = -9.715157E-3
+PU0     = 12.2704847     PUA     = 4.421816E-11   PUB     = 0
+PVSAT   = 1.707461E3     PETA0   = 1E-4           PKETA   = 2.348777E-3     )
.MODEL TSMC180nmP PMOS (                                LEVEL   = 7
+VERSION = 3.1            TNOM    = 27             TOX     = 4.1E-9
+XJ      = 1E-7           NCH     = 4.1589E17      VTH0    = -0.4120614
+K1      = 0.5590154      K2      = 0.0353896      K3      = 0
+K3B     = 7.3774572      W0      = 1E-6           NLX     = 1.103367E-7
+DVT0W   = 0              DVT1W   = 0              DVT2W   = 0
+DVT0    = 0.4301522      DVT1    = 0.2156888      DVT2    = 0.1
+U0      = 128.7704538    UA      = 1.908676E-9    UB      = 1.686179E-21
+UC      = -9.31329E-11   VSAT    = 1.658944E5     A0      = 1.6076505
+AGS     = 0.3740519      B0      = 1.711294E-6    B1      = 4.946873E-6
+KETA    = 0.0210951      A1      = 0.0244939      A2      = 1
+RDSW    = 127.0442882    PRWG    = 0.5            PRWB    = -0.5
+WR      = 1              WINT    = 5.428484E-10   LINT    = 2.468805E-8
*+XL      = -2E-8          XW      = -1E-8
+DWG     = -2.453074E-8
+DWB     = 6.408778E-9    VOFF    = -0.0974174     NFACTOR = 1.9740447
+CIT     = 0              CDSC    = 2.4E-4         CDSCD   = 0
+CDSCB   = 0              ETA0    = 0.1847491      ETAB    = -0.2531172
+DSUB    = 1.5            PCLM    = 4.8842961      PDIBLC1 = 0.0156227
+PDIBLC2 = 0.1            PDIBLCB = -1E-3          DROUT   = 0
+PSCBE1  = 1.733878E9     PSCBE2  = 5.002842E-10   PVAG    = 15
+DELTA   = 0.01           RSH     = 7.7            MOBMOD  = 1
+PRT     = 0              UTE     = -1.5           KT1     = -0.11
+KT1L    = 0              KT2     = 0.022          UA1     = 4.31E-9
+UB1     = -7.61E-18      UC1     = -5.6E-11       AT      = 3.3E4
+WL      = 0              WLN     = 1              WW      = 0
+WWN     = 1              WWL     = 0              LL      = 0
+LLN     = 1              LW      = 0              LWN     = 1
+LWL     = 0              CAPMOD  = 2              XPART   = 0.5
+CGDO    = 7.11E-10       CGSO    = 7.11E-10       CGBO    = 1E-12
+CJ      = 1.179334E-3    PB      = 0.8545261      MJ      = 0.4117753
+CJSW    = 2.215877E-10   PBSW    = 0.6162997      MJSW    = 0.2678074
+CJSWG   = 4.22E-10       PBSWG   = 0.6162997      MJSWG   = 0.2678074
+CF      = 0              PVTH0   = 2.283319E-3    PRDSW   = 5.6431992
+PK2     = 2.813503E-3    WKETA   = 2.438158E-3    LKETA   = -0.0116078
+PU0     = -2.2514581     PUA     = -7.62392E-11   PUB     = 4.502298E-24
+PVSAT   = -50            PETA0   = 1E-4           PKETA   = -1.047892E-4    )
* PHASE FREQUENCY DETECTOR
* CHARGE PUMP and LOW PASS FILTER
* VOLTAGE CONTROLLED RING OSCILLATOR
.tran 0 1 0
.backanno
.end